# EAGLE design low-voltage-shutoff (EAGLE 9.5.0)
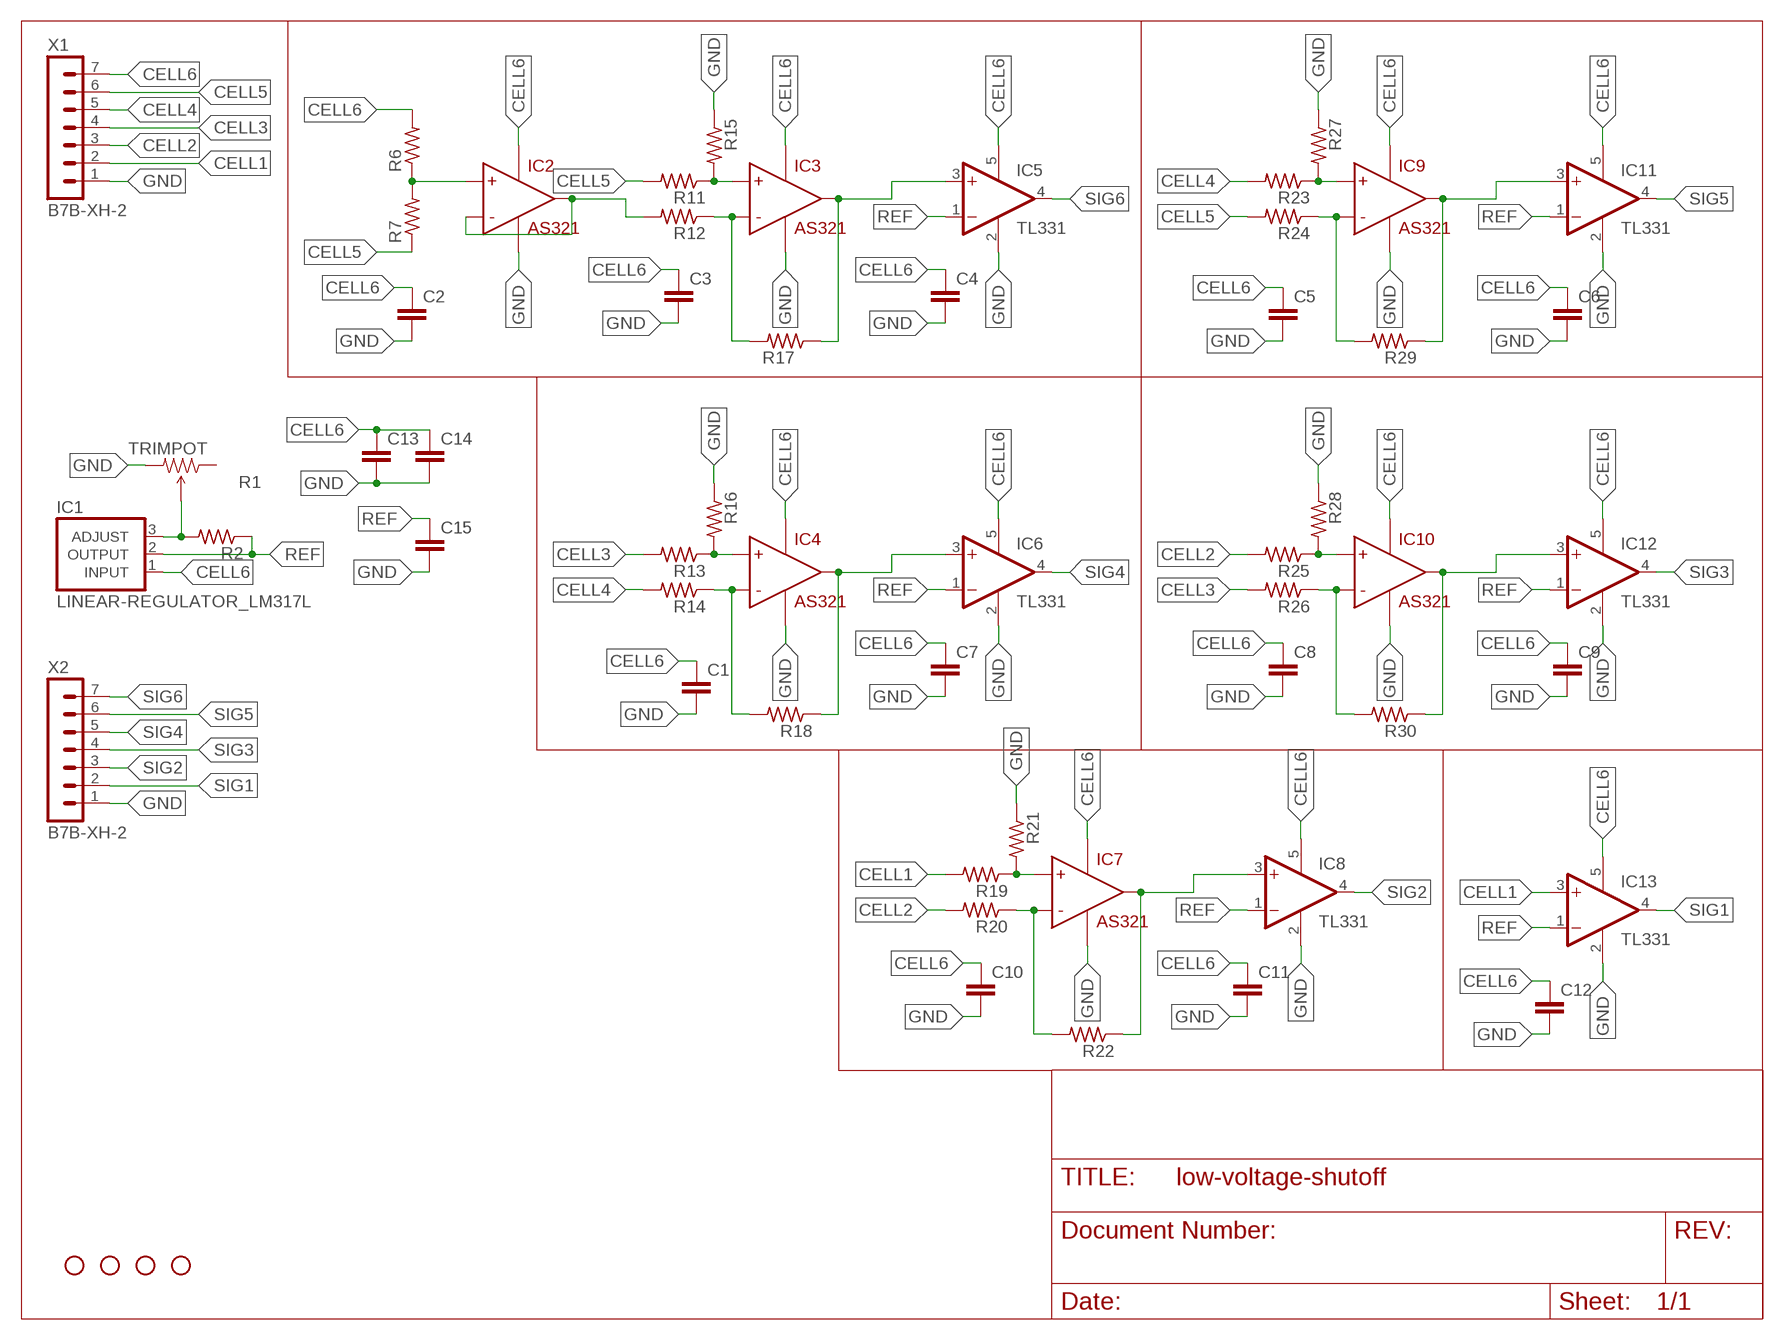
[diagram p0: schematic, sheet 1]

## Parts
C1  CAPACITOR_0805  [0805]
C2  CAPACITOR_0805  [0805]
C3  CAPACITOR_0805  [0805]
C4  CAPACITOR_0805  [0805]
C5  CAPACITOR_0805  [0805]
C6  CAPACITOR_0805  [0805]
C7  CAPACITOR_0805  [0805]
C8  CAPACITOR_0805  [0805]
C9  CAPACITOR_0805  [0805]
C10  CAPACITOR_0805  [0805]
C11  CAPACITOR_0805  [0805]
C12  CAPACITOR_0805  [0805]
C13  CAPACITOR_0805  [0805]
C14  CAPACITOR_0805  [0805]
C15  CAPACITOR_0805  [0805]
H1  STAND-OFF  [STAND-OFF]
H2  STAND-OFF  [STAND-OFF]
H3  STAND-OFF  [STAND-OFF]
H4  STAND-OFF  [STAND-OFF]
IC1  LINEAR-REGULATOR_LM317L  [TO92]
IC2  AS321  [AS321]
IC3  AS321  [AS321]
IC4  AS321  [AS321]
IC5  TL331  [DBV-R-PDSO-G5]
IC6  TL331  [DBV-R-PDSO-G5]
IC7  AS321  [AS321]
IC8  TL331  [DBV-R-PDSO-G5]
IC9  AS321  [AS321]
IC10  AS321  [AS321]
IC11  TL331  [DBV-R-PDSO-G5]
IC12  TL331  [DBV-R-PDSO-G5]
IC13  TL331  [DBV-R-PDSO-G5]
R1  TRIMPOT  [490-2877-ND]
R2  R-US_R0805  [R0805]
R6  R-US_R0805  [R0805]
R7  R-US_R0805  [R0805]
R11  R-US_R0805  [R0805]
R12  R-US_R0805  [R0805]
R13  R-US_R0805  [R0805]
R14  R-US_R0805  [R0805]
R15  R-US_R0805  [R0805]
R16  R-US_R0805  [R0805]
R17  R-US_R0805  [R0805]
R18  R-US_R0805  [R0805]
R19  R-US_R0805  [R0805]
R20  R-US_R0805  [R0805]
R21  R-US_R0805  [R0805]
R22  R-US_R0805  [R0805]
R23  R-US_R0805  [R0805]
R24  R-US_R0805  [R0805]
R25  R-US_R0805  [R0805]
R26  R-US_R0805  [R0805]
R27  R-US_R0805  [R0805]
R28  R-US_R0805  [R0805]
R29  R-US_R0805  [R0805]
R30  R-US_R0805  [R0805]
X1  B7B-XH-2  [B7B-XH-A]
X2  B7B-XH-2  [B7B-XH-A]

## Nets
CELL1: IC13.3(+IN) R19.2 X1.2
CELL2: R20.2 R25.2 X1.3
CELL3: R13.2 R26.2 X1.4
CELL4: R14.2 R23.2 X1.5
CELL5: R7.1 R11.2 R24.2 X1.6
CELL6: C1.1 C2.1 C3.1 C4.1 C5.1 C6.1 C7.1 C8.1 C9.1 C10.1 C11.1 C12.1 C13.1 C14.1 IC1.1(INPUT) IC2.5(V+) IC3.5(V+) IC4.5(V+) IC5.5(V+) IC6.5(V+) IC7.5(V+) IC8.5(V+) IC9.5(V+) IC10.5(V+) IC11.5(V+) IC12.5(V+) IC13.5(V+) R6.2 X1.7
GND: C1.2 C2.2 C3.2 C4.2 C5.2 C6.2 C7.2 C8.2 C9.2 C10.2 C11.2 C12.2 C13.2 C14.2 C15.2 IC2.2(V-) IC3.2(V-) IC4.2(V-) IC5.2(GND) IC6.2(GND) IC7.2(V-) IC8.2(GND) IC9.2(V-) IC10.2(V-) IC11.2(GND) IC12.2(GND) IC13.2(GND) R1.P$3(CW) R15.1 R16.1 R21.1 R27.1 R28.1 X1.1 X2.1
N$1: IC2.3(I-) IC2.4(OUT) R12.2
N$2: IC2.1(I+) R6.1 R7.2
N$3: IC3.1(I+) R11.1 R15.2
N$4: IC3.3(I-) R12.1 R17.2
N$5: IC3.4(OUT) IC5.3(+IN) R17.1
N$6: IC4.1(I+) R13.1 R16.2
N$7: IC4.3(I-) R14.1 R18.2
N$8: IC9.1(I+) R23.1 R27.2
N$9: IC9.3(I-) R24.1 R29.2
N$10: IC9.4(OUT) IC11.3(+IN) R29.1
N$11: IC4.4(OUT) IC6.3(+IN) R18.1
N$12: IC10.1(I+) R25.1 R28.2
N$13: IC10.3(I-) R26.1 R30.2
N$14: IC10.4(OUT) IC12.3(+IN) R30.1
N$15: IC7.1(I+) R19.1 R21.2
N$16: IC7.3(I-) R20.1 R22.2
N$17: IC7.4(OUT) IC8.3(+IN) R22.1
N$18: IC1.3(ADJUST) R1.P$2(WIPER) R2.2
REF: C15.1 IC1.2(OUTPUT) IC5.1(-IN) IC6.1(-IN) IC8.1(-IN) IC11.1(-IN) IC12.1(-IN) IC13.1(-IN) R2.1
SIG1: IC13.4(OUT) X2.2
SIG2: IC8.4(OUT) X2.3
SIG3: IC12.4(OUT) X2.4
SIG4: IC6.4(OUT) X2.5
SIG5: IC11.4(OUT) X2.6
SIG6: IC5.4(OUT) X2.7
Unconnected: R1.P$1(CCW)

## Library data of the parts
C1-C15 = EcoCar-Passives:CAPACITOR_0805
H1-H4 = EcoCar-Miscellaneous:STAND-OFF: Stand Off Drill holes for mechanically mounting via screws, standoffs, etc. Note: Use the keepout ring to avoid running the screw head into surrounding components. Variant Overviews STAND-OFF - Mechanical footprint for a #4 phillips button head screw. STAND-OFF-TIGHT - Mechanical footprint for a #4 phillips button head screw, Example SparkFun Products Screw - Phillips Head (1/4", 4-40, 10 pack) <https://www.sparkfun.com/products/10453> (PRT-10453) Screw - Phillips Head (1/2", 4-40, 10 pack) <https://www.sparkfun.com/products/10452> (PRT-10452) Screw - Phillips Head (3/4", 4-40, 10 pack) <https://www.sparkfun.com/products/10451> (PRT-10451) Screw - Phillips Head (1", 4-40, 10 pack) <https://www.sparkfun.com/products/10450> (PRT-10450)
IC1 = EcoCar-Integrated-Circuits:LINEAR-REGULATOR_LM317L: Adjustable Positive Linear Voltage Regulator Manufacturer: Texas Instruments Part Number: LM317LILPR Digikey Part Number: 296-20679-1-ND
IC2-IC4 IC7 IC9 IC10 = AS321:AS321: Digikey PArt #: AS321KTR-E1
IC5 IC6 IC8 IC11-IC13 = linear:TL331: SINGLE DIFFERENTIAL COMPARATOR Source: Data sheet <http://www.ti.com/lit/ds/symlink/tl331-q1.pdf>
R1 = trimpot:TRIMPOT
R2 R6 R7 R11-R30 = rcl:R-US_: RESISTOR, American symbol; SPICEPREFIX: R
X1 X2 = con-JST:B7B-XH: JST XH series header 2.50mm pitch disconnectable crimp style connectors, vertical (side entry type), 7 pins

## Board
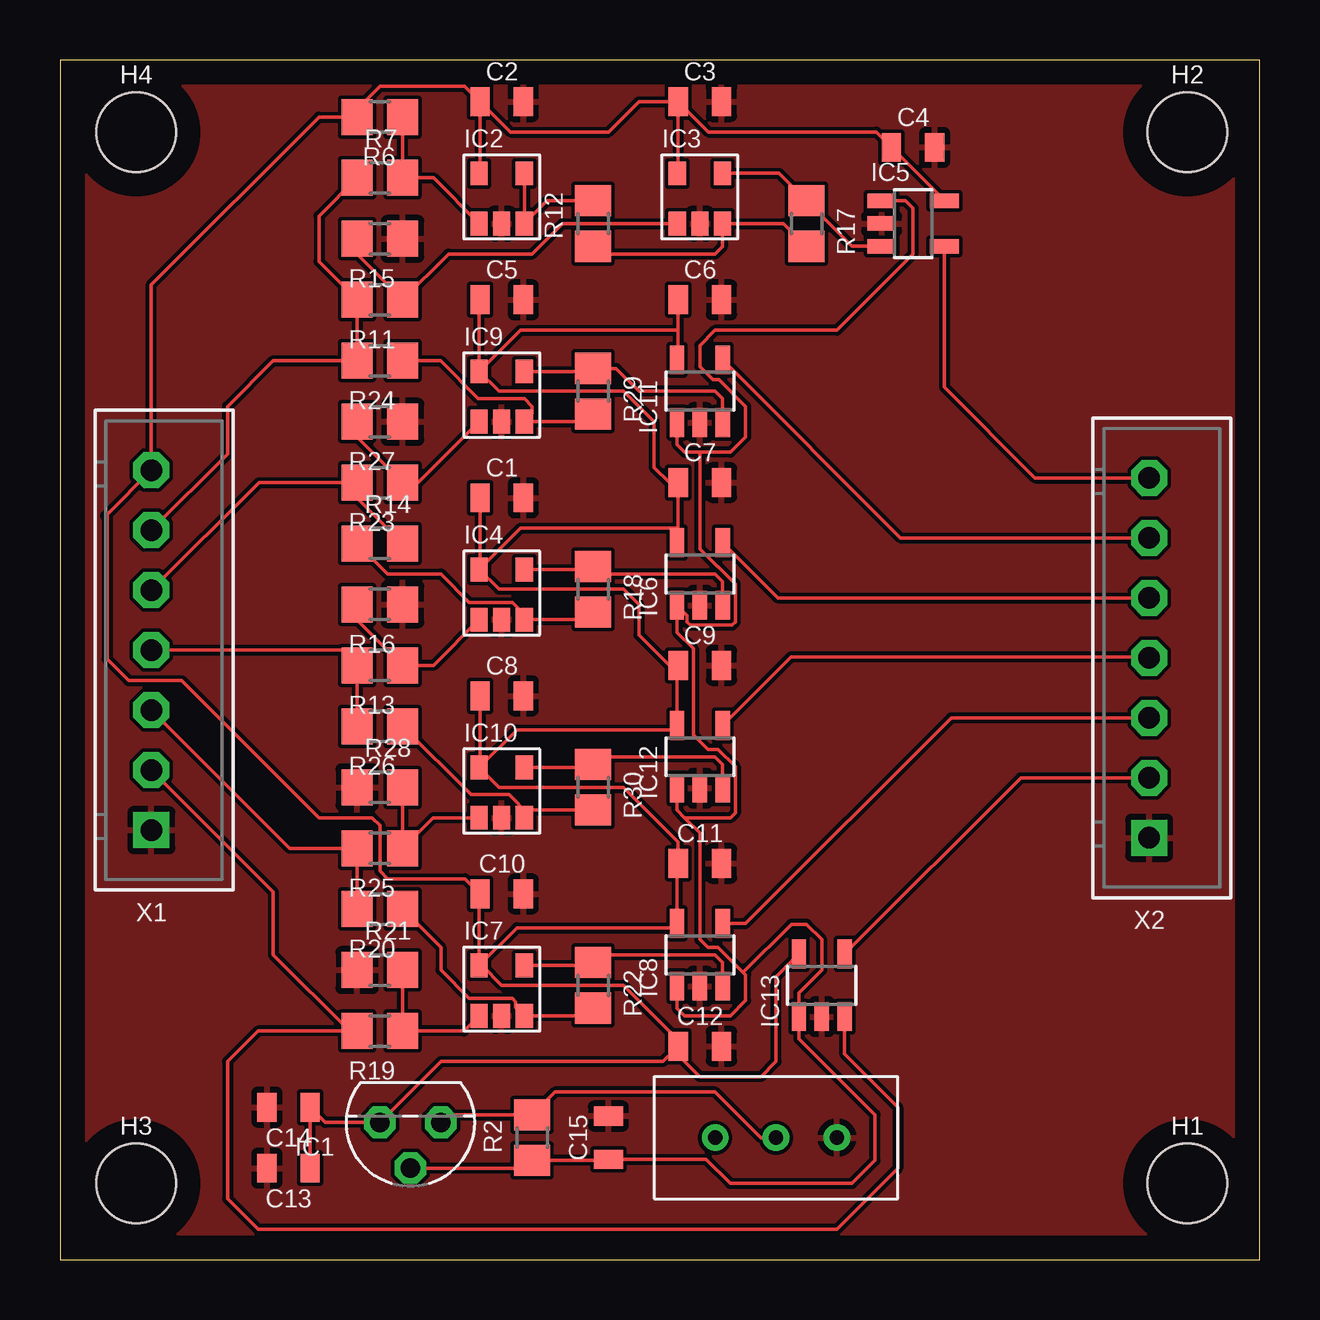
[diagram p1: board, top side]

Size 50 x 50 mm. Coordinates in mm from the lower left corner, seen from the top.
Outline: 0,0 50,0 50,50 0,50 0,0
Copper layers (1*16): Top 0.035mm / dielectric 1.5mm / Bottom 0.035mm
Design rules "default": minimum track width 6mil, minimum drill 0.35mm, track to track 6mil, track to pad 6mil, pad to pad 6mil, via to via 6mil, smd to smd 6mil, copper to edge 40mil, drill to drill 6mil, minimum pad ring 10mil, minimum via ring 8mil, stop-mask expansion 4mil, vias tented up to drill 0mil, thermal gap 10mil

### Footprints (pad centres in the part's own frame; a part is rotated, then mirrored left to right if it is on the bottom)
0805 = smd 0.8 x 1.2: 1 -0.9,0; 2 0.9,0
STAND-OFF = hole 3.302: 0,0
TO92 = drill 0.813 octagon: 1 1.27,0; 2 0,1.905; 3 -1.27,0
AS321 = smd 0.711 x 0.991: 1 -0.94,0; 2 0,0; 3 0.94,0; 4 0.94,2.095; 5 -0.94,2.095
DBV-R-PDSO-G5 = smd 0.6 x 1.2: 1 -0.95,-1.306; 2 0,-1.306; 3 0.95,-1.306; 4 0.95,1.306; 5 -0.95,1.306
490-2877-ND = drill 0.6: P$1 0,-2.54; P$2 0,0; P$3 0,2.54
R0805 = smd 1.3 x 1.5: 1 -0.95,0; 2 0.95,0
B7B-XH-A = drill 0.9 pad 1.5 square: 1 7.5,0 | drill 0.9 pad 1.5 octagon: 2 5,0; 3 2.5,0; 4 0,0; 5 -2.5,0; 6 -5,0; 7 -7.5,0

### Placement (x,y rotation side)
C1  18.41,31.75 0 top
C2  18.41,48.26 0 top
C3  26.67,48.26 0 top
C4  35.56,46.35 0 top
C5  18.41,40.01 0 top
C6  26.67,40.01 0 top
C7  26.67,32.38 0 top
C8  18.41,23.5 0 top
C9  26.67,24.77 0 top
C10  18.41,15.24 0 top
C11  26.67,16.51 0 top
C12  26.67,8.89 0 top
C13  9.53,3.81 180 top
C14  9.53,6.35 180 top
C15  22.86,5.08 90 top
H1  46.99,3.17 0 top
H2  46.99,46.99 0 top
H3  3.17,3.17 0 top
H4  3.17,46.99 0 top
IC1  14.61,5.71 180 top
IC2  18.41,43.18 0 top
IC3  26.67,43.18 0 top
IC4  18.41,26.67 0 top
IC5  35.56,43.18 270 top
IC6  26.67,28.57 0 top
IC7  18.41,10.16 0 top
IC8  26.67,12.7 0 top
IC9  18.41,34.92 0 top
IC10  18.41,18.41 0 top
IC11  26.67,36.2 0 top
IC12  26.67,20.95 0 top
IC13  31.75,11.43 0 top
R1  29.84,5.08 270 top
R2  19.68,5.08 90 top
R6  13.34,47.62 180 top
R7  13.34,45.09 0 top
R11  13.34,40.01 180 top
R12  22.23,43.18 90 top
R13  13.34,24.77 180 top
R14  13.34,29.84 0 top
R15  13.34,42.55 180 top
R16  13.34,27.3 180 top
R17  31.11,43.18 270 top
R18  22.23,27.94 270 top
R19  13.34,9.53 180 top
R20  13.34,14.61 180 top
R21  13.34,12.06 0 top
R22  22.23,11.43 270 top
R23  13.34,32.38 180 top
R24  13.34,37.47 180 top
R25  13.34,17.14 180 top
R26  13.34,22.23 180 top
R27  13.34,34.92 180 top
R28  13.34,19.68 0 top
R29  22.23,36.2 270 top
R30  22.23,19.68 270 top
X1  3.81,25.4 270 top
X2  45.4,25.08 270 top

### Tracks (layer width: path | path; a pad name or v marks a point on that pad's centre or on a via)
CELL1
  Top 0.152: R19.2 12.06,9.53 | 12.06,9.53 8.26,9.53 6.99,8.26 6.99,2.54 8.26,1.27 32.38,1.27 34.92,3.81 34.92,6.35 32.7,8.57 IC13.3 | X1.2 8.89,15.32 8.89,12.7 12.06,9.53
CELL2
  Top 0.152: X1.3 9.56,17.14 R25.2 R20.2
CELL3
  Top 0.152: X1.4 11.75,25.4 R13.2 R26.2
CELL4
  Top 0.152: X1.5 8.29,32.38 R23.2 12.38,31.75 R14.2
CELL5
  Top 0.152: R7.1 10.79,43.49 10.79,41.59 R11.2 R24.2 8.89,37.47 6.99,35.56 6.99,33.58 X1.6
CELL6
  Top 0.152: C2.1 16.87,48.91 13.34,48.91 12.38,47.96 R6.2 10.79,47.62 3.81,40.64 X1.7 1.97,31.05 | C2.1 18.79,46.99 22.86,46.99 24.13,48.26 C3.1 | C2.1 17.52,45.31 IC2.5 | C3.1 25.77,45.31 IC3.5 | C3.1 27.04,46.99 34.02,46.99 C4.1 36.87,44.15 IC5.5 | C6.1 25.77,38.73 | 25.77,38.73 25.77,37.55 IC11.5 | 25.77,30.48 C7.1 25.4,32.38 24.77,33.02 24.77,34.92 23.5,36.2 18.3,36.2 IC9.5 | 25.77,30.48 25.77,29.93 IC6.5 | C13.1 C14.1 11.06,5.71 IC1.1 15.88,8.26 25.14,8.26 25.59,8.71 | IC7.5 17.48,15.2 C10.1 16.88,15.88 13.65,15.88 13.34,16.19 13.34,18.1 13.02,18.41 10.79,18.41 5.08,24.13 2.86,24.13 1.97,25.02 1.97,31.05 | C8.1 17.52,20.55 IC10.5 | C1.1 17.52,28.8 IC4.5 | IC9.5 17.48,39.97 C5.1 | IC9.5 19.19,38.73 25.77,38.73 | IC4.5 19.19,30.48 25.77,30.48 | IC10.5 19.05,22.08 25.54,22.08 IC12.5 25.72,24.71 C9.1 25.4,24.77 24.13,26.04 24.13,27.3 23.5,27.94 18.3,27.94 IC4.5 | IC7.5 19.05,13.83 25.54,13.83 IC8.5 25.72,16.46 C11.1 25.77,17.41 23.5,19.68 18.3,19.68 IC10.5 | IC7.5 17.59,12.26 18.41,11.43 23.5,11.43 25.77,9.15 C12.1 25.59,8.71 | 25.59,8.71 26.67,7.62 29.21,7.62 29.84,8.26 29.84,11.78 IC13.5 | 1.97,31.05 1.91,31
GND
  pour Top: -5.71,55.88 54.61,55.88 54.61,-3.81 -5.71,-3.81
N$1
  Top 0.152: IC2.3 19.52,43.34 | 19.52,43.34 20.3,44.13 R12.2 | IC2.4 19.36,43.51 19.52,43.34
N$2
  Top 0.152: R6.1 R7.2 15.57,45.09 IC2.1
N$3
  Top 0.152: R15.2 12.38,41.91 R11.1 16.19,41.91 19.68,41.91 20.95,43.18 IC3.1
N$4
  Top 0.152: R17.2 30.16,43.18 IC3.3 27.61,42.22 27.3,41.91 22.55,41.91 R12.1
N$5
  Top 0.152: IC3.4 29.97,45.28 R17.1 33.02,42.23 IC5.3
N$6
  Top 0.152: IC4.1 15.57,24.77 R13.1 12.38,26.66 R16.2
N$7
  Top 0.152: IC4.3 19.59,26.67 | R18.2 21.91,26.67 19.68,26.67 19.59,26.67 | R14.1 13.65,28.57 15.88,28.57 17.06,27.39 18.86,27.39 19.59,26.67
N$8
  Top 0.152: R27.2 12.38,34.28 R23.1 14.94,32.38 IC9.1
N$9
  Top 0.152: R29.2 21.91,34.92 IC9.3 19.68,35.26 19.68,35.56 19.36,35.89 17.43,35.89 15.86,37.47 R24.1
N$10
  Top 0.152: IC9.4 22.1,37.02 R29.1 23.18,37.15 24.13,36.2 27.3,36.2 27.62,35.88 IC11.3
N$11
  Top 0.152: IC4.4 22.1,28.77 | 22.1,28.77 R18.1 | IC6.3 27.62,28.26 27.3,28.57 22.29,28.57 22.1,28.77
N$12
  Top 0.152: R28.2 R25.1 15.55,18.41 IC10.1
N$13
  Top 0.152: IC10.3 19.52,18.58 | 19.52,18.58 19.68,18.73 R30.2 | R26.1 17.13,19.38 18.72,19.38 19.52,18.58
N$14
  Top 0.152: IC10.4 22.1,20.51 R30.1 22.55,20.95 27.3,20.95 27.62,20.64 IC12.3
N$15
  Top 0.152: IC7.1 16.84,9.53 R19.1 R21.2
N$16
  Top 0.152: R22.2 21.91,10.16 IC7.3 19,10.52 19,10.75 18.86,10.88 17.06,10.88 15.88,12.06 15.88,13.02 R20.1
N$17
  Top 0.152: IC7.4 22.1,12.26 R22.1 22.55,12.7 27.3,12.7 27.62,12.38 IC8.3
N$18
  Top 0.152: IC1.3 16.19,6.03 R2.2 20.64,6.99 27.3,6.99 29.21,5.08 R1.P$2
REF
  Top 0.152: IC1.2 19.36,3.81 R2.1 22.81,4.13 C15.1 26.93,4.18 27.94,3.17 33.02,3.17 33.97,4.13 33.97,6.03 30.8,9.21 IC13.1 30.8,11.12 31.75,12.06 31.75,13.34 31.11,13.97 30.48,13.97 28.47,11.96 | IC8.1 25.72,10.47 26.04,10.16 27.94,10.16 28.57,10.79 28.57,11.86 28.47,11.96 | IC5.1 35.24,44.13 35.56,43.81 35.56,41.91 32.38,38.73 27.3,38.73 26.67,38.1 26.67,37.23 27.23,36.67 27.46,36.67 28.57,35.56 28.57,34.29 27.94,33.66 26.67,33.66 | 26.67,33.66 26.04,33.66 25.72,33.97 IC11.1 | 26.67,33.66 26.67,29.61 27.4,28.88 27.43,28.88 28.15,28.16 28.15,26.57 28.02,26.44 26.27,26.44 26.14,26.57 26.14,26.85 IC6.1 25.72,26.14 26.4,25.46 26.4,21.86 27,21.26 27.43,21.26 28.15,20.54 28.15,18.62 27.94,18.41 26.04,18.41 | 26.04,18.41 25.72,18.73 IC12.1 | 28.47,11.96 27.43,13.01 27,13.01 26.67,13.34 26.67,17.78 26.04,18.41
SIG1
  Top 0.152: X2.2 40.05,20.08 IC13.4
SIG2
  Top 0.152: X2.3 37.15,22.58 28.57,14.01 IC8.4
SIG3
  Top 0.152: X2.4 45.37,25.12 30.48,25.12 IC12.4
SIG4
  Top 0.152: IC6.4 29.92,27.58 X2.5
SIG5
  Top 0.152: IC11.4 35.04,30.08 X2.6
SIG6
  Top 0.152: IC5.4 36.87,36.36 40.64,32.58 X2.7